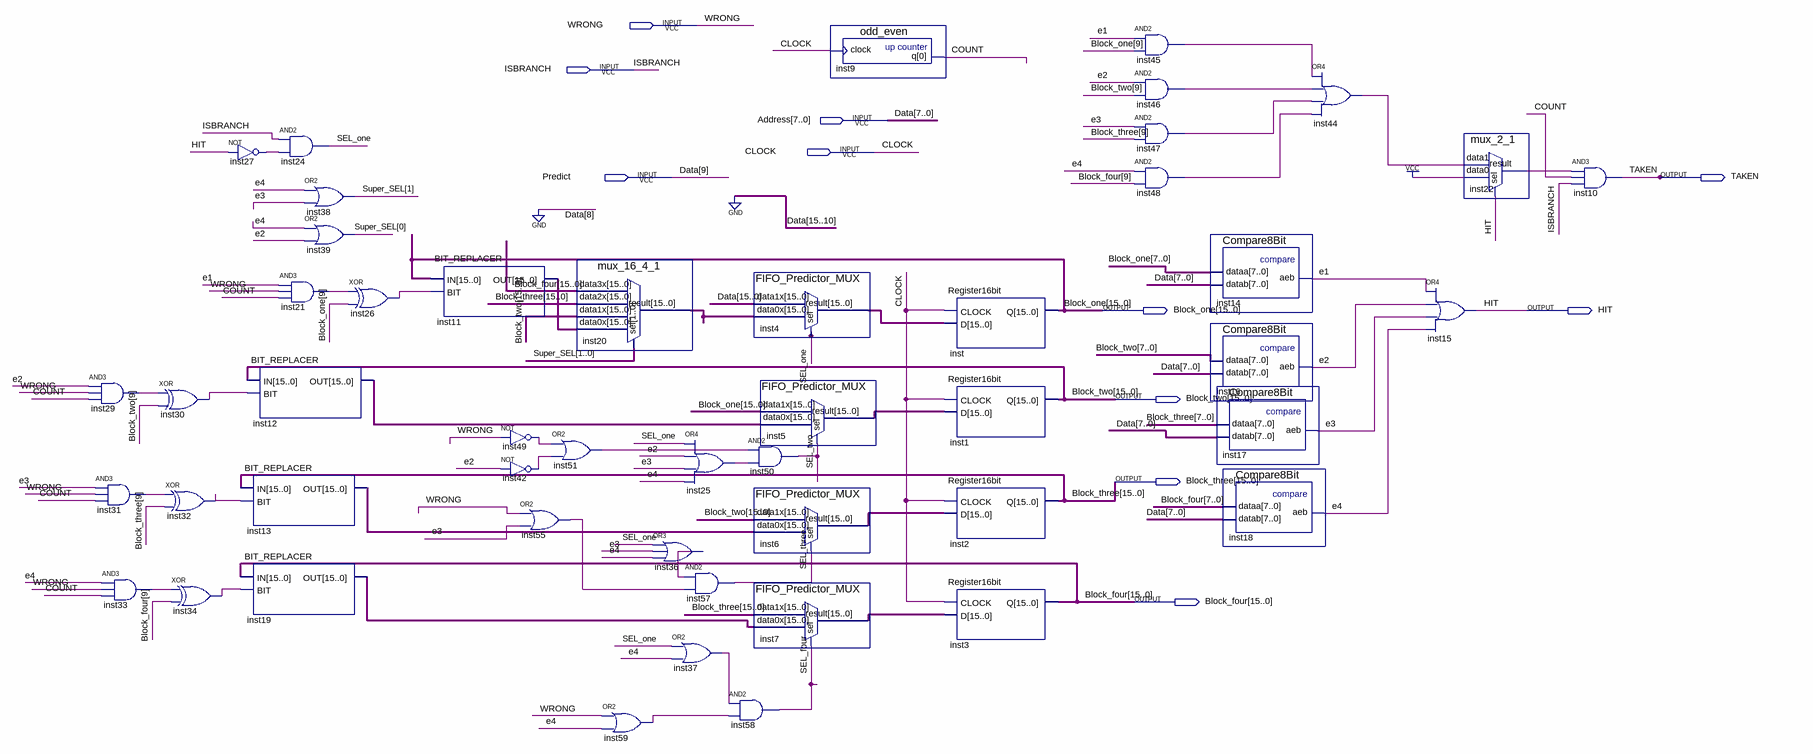
[diagram p0: schematic sheet]
// Quartus schematic LRU_Branch_Predictor.bdf as structural Verilog: 49 symbols, 11 pins
module LRU_Branch_Predictor (
  input  WRONG,
  input  ISBRANCH,
  input  [7:0] Address,
  input  CLOCK,
  input  Predict,
  output TAKEN,
  output [15:0] Block_one,
  output HIT,
  output [15:0] Block_two,
  output [15:0] Block_three,
  output [15:0] Block_four
);

  wire COUNT, e1, e2, e3, e4, inst21_out, inst22_result, inst25_out, inst26_out, inst27_out, inst29_out,
       inst30_out, inst31_out, inst32_out, inst33_out, inst34_out, inst36_out, inst37_out, inst42_out,
       inst44_out, inst45_out, inst46_out, inst47_out, inst48_out, inst49_out, inst51_out, inst55_out,
       inst59_out, SEL_four, SEL_one, SEL_three, SEL_two;
  wire [1:0] Super_SEL;
  wire [15:0] inst4_result, inst5_result, inst6_result, inst7_result, inst11_out, inst12_out, inst13_out,
       inst19_out, inst20_result;

  and inst29 (inst29_out, e2, WRONG, COUNT);
  and inst31 (inst31_out, e3, WRONG, COUNT);
  and inst33 (inst33_out, e4, WRONG, COUNT);
  xor inst30 (inst30_out, inst29_out, Block_two[9]);
  xor inst32 (inst32_out, inst31_out, Block_three[9]);
  xor inst34 (inst34_out, inst33_out, Block_four[9]);
  not inst27 (inst27_out, HIT);
  BIT_REPLACER inst13 (.IN(Block_three), .BIT(inst32_out), .OUT(inst13_out));
  BIT_REPLACER inst19 (.IN(Block_four), .BIT(inst34_out), .OUT(inst19_out));
  and inst24 (SEL_one, ISBRANCH, inst27_out);
  and inst21 (inst21_out, e1, WRONG, COUNT);
  BIT_REPLACER inst12 (.IN(Block_two), .BIT(inst30_out), .OUT(inst12_out));
  or inst38 (Super_SEL[1], e4, e3);
  or inst39 (Super_SEL[0], e4, e2);
  xor inst26 (inst26_out, inst21_out, Block_one[9]);
  BIT_REPLACER inst11 (.IN(Block_one), .BIT(inst26_out), .OUT(inst11_out));
  not inst49 (inst49_out, WRONG);
  not inst42 (inst42_out, e2);
  or inst55 (inst55_out, WRONG, e3);
  mux_16_4_1 inst20 (
    .data3x(Block_four), .data2x(Block_three), .data1x(Block_two), .data0x(inst11_out), .sel(Super_SEL),
    .result(inst20_result));
  or inst51 (inst51_out, inst49_out, inst42_out);
  or inst59 (inst59_out, WRONG, e4);
  or inst25 (inst25_out, SEL_one, e2, e3, e4);
  or inst36 (inst36_out, SEL_one, e3, e4);
  and inst57 (SEL_three, inst36_out, inst55_out);
  or inst37 (inst37_out, SEL_one, e4);
  and inst50 (SEL_two, inst51_out, inst25_out);
  and inst58 (SEL_four, inst37_out, inst59_out);
  FIFO_Predictor_MUX inst4 (
    .data1x({{6{1'b0}}, Predict, 1'b0, Address}), .data0x(inst20_result), .sel(SEL_one), .result(inst4_result));
  FIFO_Predictor_MUX inst5 (.data1x(Block_one), .data0x(inst12_out), .sel(SEL_two), .result(inst5_result));
  FIFO_Predictor_MUX inst6 (.data1x(Block_two), .data0x(inst13_out), .sel(SEL_three), .result(inst6_result));
  FIFO_Predictor_MUX inst7 (.data1x(Block_three), .data0x(inst19_out), .sel(SEL_four), .result(inst7_result));
  odd_even inst9 (.clock(CLOCK), .q(COUNT));
  Register16bit inst (.CLOCK(CLOCK), .D(inst4_result), .Q(Block_one));
  Register16bit inst1 (.CLOCK(CLOCK), .D(inst5_result), .Q(Block_two));
  Register16bit inst2 (.CLOCK(CLOCK), .D(inst6_result), .Q(Block_three));
  Register16bit inst3 (.CLOCK(CLOCK), .D(inst7_result), .Q(Block_four));
  and inst45 (inst45_out, e1, Block_one[9]);
  and inst46 (inst46_out, e2, Block_two[9]);
  and inst47 (inst47_out, e3, Block_three[9]);
  and inst48 (inst48_out, e4, Block_four[9]);
  Compare8Bit inst14 (.dataa(Block_one[7:0]), .datab(Address), .aeb(e1));
  Compare8Bit inst16 (.dataa(Block_two[7:0]), .datab(Address), .aeb(e2));
  Compare8Bit inst17 (.dataa(Block_three[7:0]), .datab(Address), .aeb(e3));
  Compare8Bit inst18 (.dataa(Block_four[7:0]), .datab(Address), .aeb(e4));
  or inst44 (inst44_out, inst45_out, inst46_out, inst47_out, inst48_out);
  or inst15 (HIT, e1, e2, e3, e4);
  mux_2_1 inst22 (.data1(inst44_out), .data0(1'b1), .sel(HIT), .result(inst22_result));
  and inst10 (TAKEN, inst22_result, COUNT, ISBRANCH);

  // Other names for the same wires on the sheet: Data (some bits) = {Predict, Address}
endmodule
